# EasyEDA Pro project STM32F412VEx-Core.eprj

# Schematic Schematic1
Create Date: 2022-10-27; Page Name: P1; Project Name: STM32F412VEx-Core; Schematic Name: Schematic1; Update Date: 2022-10-28; Company: 嘉立创EDA; Page Size: A4; Version: V1.0
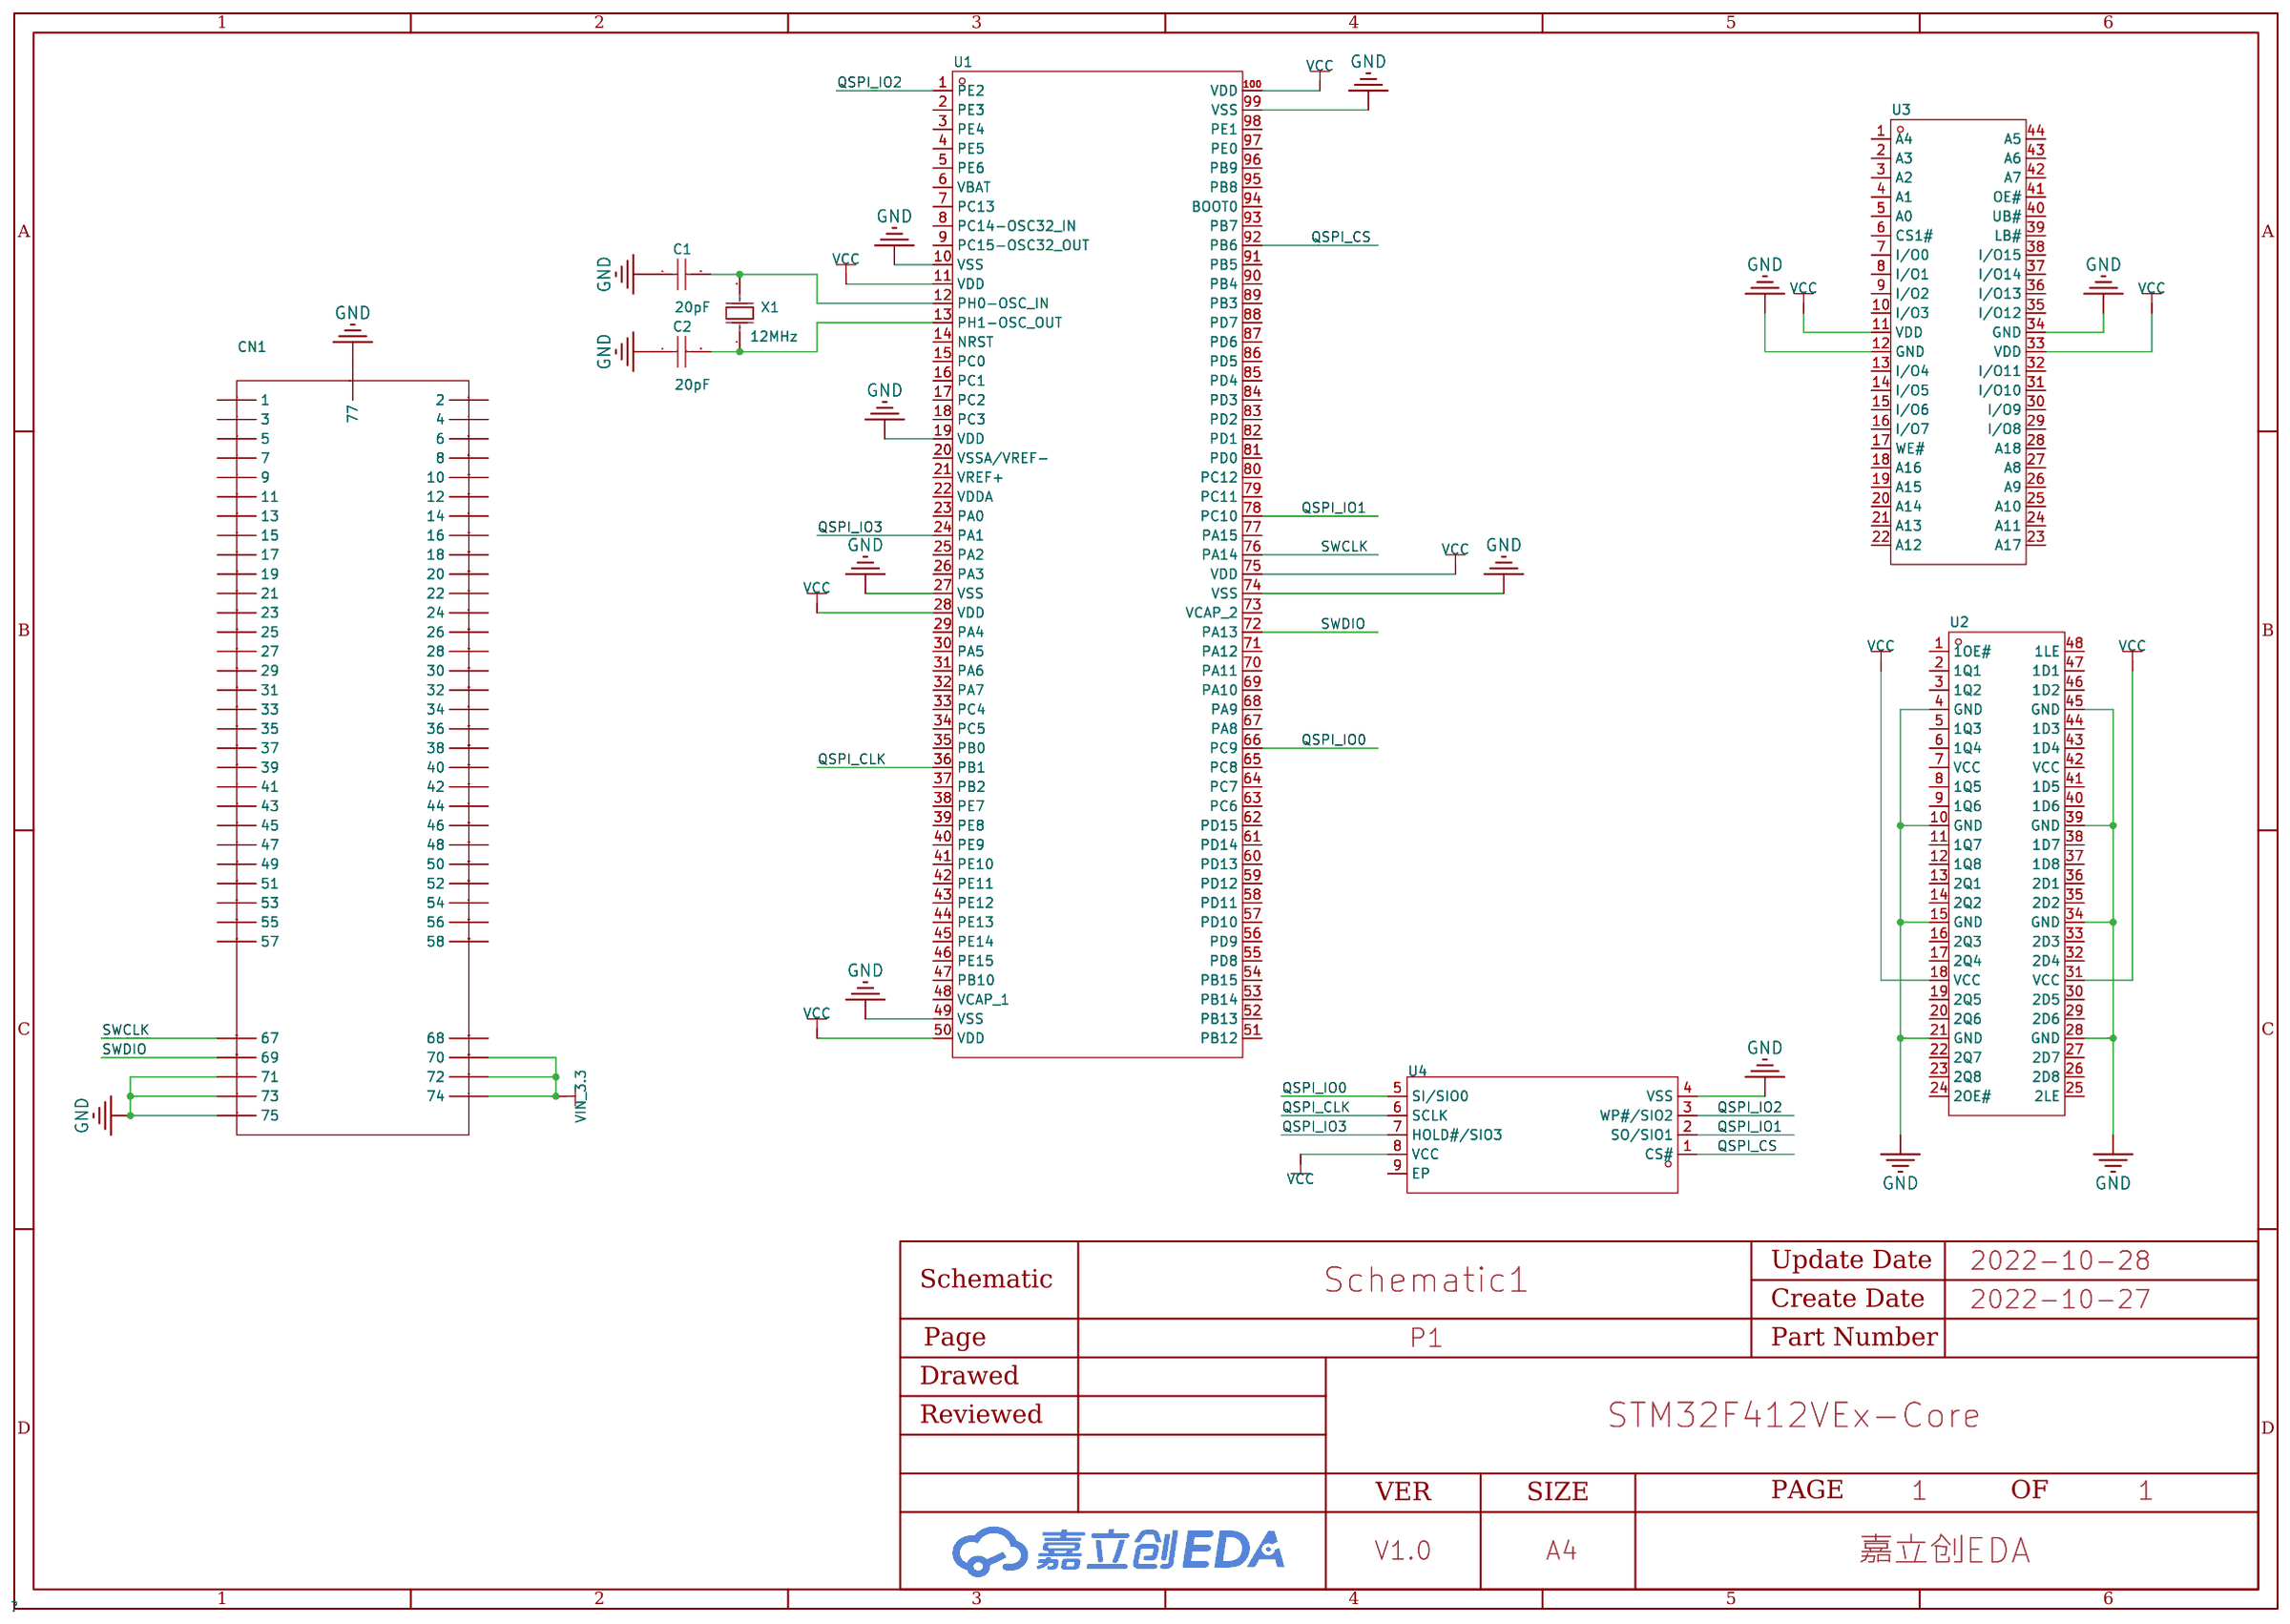
[diagram p0: schematic sheet]

## Parts
C1  20pF  [C0402]
C2  20pF  [C0402]
CN1  -  [M.2_67P_0.5mm_M-key]
U1  STM32F412VET6  [LQFP-100_L14.0-W14.0-P0.50-LS16.0-BL]
U2  SN74ALVCH16373DGGR  [TSSOP-48_L12.6-W6.2-P0.50-LS8.1-BL]
U3  IS62WV51216EBLL-45TLI  [TSOPII-44_L18.4-W10.2-P0.80-LS11.8-BL]
U4  XT26Q01DWSIGA  [WSON-8_L8.0-W6.0-P1.27-TL-EP-1]
X1  12MHz  [OSC-SMD_L5.0-W3.2]

## Library data of the parts
C1 C2 = 0402CG200J500NT: 温度系数:C0G;容值:20pF;精度:±5%;额定电压:50V;; LCSC Part Name: 20pF(200) ±5% 50V; Supplier Part: C1554; Manufacturer: FH(风华); Supplier Footprint: 0402; JLCPCB Part Class: 基础库; Datasheet: https://atta.szlcsc.com/upload/public/pdf/source/20170923/C1554_1506149268708988361.pdf; Supplier: LCSC; Temperature Coefficient: C0G; Tolerance: ±5%; Voltage Rated: 50V
CN1 = M.2_2230_67P_0.5mm_M-key
U1 = STM32F412VET6: Supplier Part: C1337550; Manufacturer: ST(意法半导体); Supplier Footprint: LQFP-100(14x14); JLCPCB Part Class: 扩展库; Datasheet: https://atta.szlcsc.com/upload/public/pdf/source/20200508/C528747_B60DB4B534ED5B42A2F95FC5A7327F53.pdf; Supplier: LCSC
U2 = SN74ALVCH16373DGGR: 系列:74ALVCH;逻辑类型:D 型透明锁存器;输出类型:三态;电压-电源:1.65V ~ 3.6V;; Supplier Part: C139348; Manufacturer: TI(德州仪器); Supplier Footprint: TSSOP-48; JLCPCB Part Class: 扩展库; Datasheet: https://atta.szlcsc.com/upload/public/pdf/source/20171107/C139348_15100518937731097252.pdf; Supplier: LCSC; Series: 74ALVCH; Logic Type: D 型透明锁存器; Output Type: 三态; Voltage - Supply: 1.65V ~ 3.6V
U3 = IS62WV51216EBLL-45TLI: LCSC Part Name: IS62WV51216EBLL 45TLI; Supplier Part: C1348903; Manufacturer: ISSI(美国芯成); Supplier Footprint: TSOP-44; JLCPCB Part Class: 扩展库; Datasheet: https://atta.szlcsc.com/upload/public/pdf/source/20210424/B901F7E8201E5631B8BDF1A41AB0F019.pdf; Supplier: LCSC
U4 = XT26Q01DWSIGA: LCSC Part Name: 1Gbit 1.8V SPI NAND Quad I/O; Supplier Part: C3019013; Manufacturer: XTX(芯天下); Supplier Footprint: 8-WSON(8x6)mm; Datasheet: https://atta.szlcsc.com/upload/public/pdf/source/20220517/C1E7A63E586809554540A7FC37CE75B5.pdf; Supplier: LCSC
X1 = X503212MSB2GI: 晶振类型:贴片无源晶振;频率:12MHz;频率公差:±10ppm;频率稳定度:±50ppm;负载电容:20pF;工作温度:-40~+85;; LCSC Part Name: 12MHz ±10ppm 20pF; Supplier Part: C112573; Manufacturer: YXC(扬兴晶振); Supplier Footprint: SMD5032-2P; JLCPCB Part Class: 扩展库; Datasheet: https://atta.szlcsc.com/upload/public/pdf/source/20210329/C112559_847D3CACBA33ACCEB57DEA3AEBB187A1.pdf; Supplier: LCSC; Crystal Type: 贴片无源晶振; Frequency Tolerance: ±10ppm; Frequency Stability: ±50ppm; Load Capacitance: 20pF; Operating Temperature: -40~+85

## Nets
GND: C1.1 C2.1 CN1.71 CN1.73 CN1.75 CN1.77 U1.10(VSS) U1.19(VDD) U1.27(VSS) U1.49(VSS) U1.74(VSS) U1.99(VSS) U2.4(GND) U2.10(GND) U2.15(GND) U2.21(GND) U2.28(GND) U2.34(GND) U2.39(GND) U2.45(GND) U3.12(GND) U3.34(GND) U4.4(VSS)
VCC: U1.11(VDD) U1.28(VDD) U1.50(VDD) U1.75(VDD) U1.100(VDD) U2.18(VCC) U2.31(VCC) U3.11(VDD) U3.33(VDD) U4.8(VCC)
VIN_3.3: CN1.70 CN1.72 CN1.74
QSPI_CLK: U1.36(PB1) U4.6(SCLK)
QSPI_CS: U1.92(PB6) U4.1(CS#)
QSPI_IO0: U1.66(PC9) U4.5(SI/SIO0)
QSPI_IO1: U1.78(PC10) U4.2(SO/SIO1)
QSPI_IO2: U1.1(PE2) U4.3(WP#/SIO2)
QSPI_IO3: U1.24(PA1) U4.7(HOLD#/SIO3)
SWCLK: CN1.67 U1.76(PA14)
SWDIO: CN1.69 U1.72(PA13)
$1N4704: C2.2 U1.13(PH1-OSC_OUT) X1.1(OSC1)
$1N6546: C1.2 U1.12(PH0-OSC_IN) X1.2(OSC2)

Not connected (* = marked no-connect by the designer): CN1 1 2 3 4 5 6 7 8 9 10 11 12 13 14 15 16 17 18 19 20 21 22 23 24 25 26 27 28 29 30 31 32 33 34 35 36 37 38 39 40 41 42 43 44 45 46 47 48 49 50 51 52 53 54 55 56 57 58 68; U1 2(PE3) 3(PE4) 4(PE5) 5(PE6) 6(VBAT) 7(PC13) 8(PC14-OSC32_IN) 9(PC15-OSC32_OUT) 14(NRST) 15(PC0) 16(PC1) 17(PC2) 18(PC3) 20(VSSA/VREF-) 21(VREF+) 22(VDDA) 23(PA0) 25(PA2) 26(PA3) 29(PA4) 30(PA5) 31(PA6) 32(PA7) 33(PC4) 34(PC5) 35(PB0) 37(PB2) 38(PE7) 39(PE8) 40(PE9) 41(PE10) 42(PE11) 43(PE12) 44(PE13) 45(PE14) 46(PE15) 47(PB10) 48(VCAP_1) 51(PB12) 52(PB13) 53(PB14) 54(PB15) 55(PD8) 56(PD9) 57(PD10) 58(PD11) 59(PD12) 60(PD13) 61(PD14) 62(PD15) 63(PC6) 64(PC7) 65(PC8) 67(PA8) 68(PA9) 69(PA10) 70(PA11) 71(PA12) 73(VCAP_2) 77(PA15) 79(PC11) 80(PC12) 81(PD0) 82(PD1) 83(PD2) 84(PD3) 85(PD4) 86(PD5) 87(PD6) 88(PD7) 89(PB3) 90(PB4) 91(PB5) 93(PB7) 94(BOOT0) 95(PB8) 96(PB9) 97(PE0) 98(PE1); U2 1(1OE#) 2(1Q1) 3(1Q2) 5(1Q3) 6(1Q4) 7(VCC) 8(1Q5) 9(1Q6) 11(1Q7) 12(1Q8) 13(2Q1) 14(2Q2) 16(2Q3) 17(2Q4) 19(2Q5) 20(2Q6) 22(2Q7) 23(2Q8) 24(2OE#) 25(2LE) 26(2D8) 27(2D7) 29(2D6) 30(2D5) 32(2D4) 33(2D3) 35(2D2) 36(2D1) 37(1D8) 38(1D7) 40(1D6) 41(1D5) 42(VCC) 43(1D4) 44(1D3) 46(1D2) 47(1D1) 48(1LE); U3 1(A4) 2(A3) 3(A2) 4(A1) 5(A0) 6(CS1#) 7(I/O0) 8(I/O1) 9(I/O2) 10(I/O3) 13(I/O4) 14(I/O5) 15(I/O6) 16(I/O7) 17(WE#) 18(A16) 19(A15) 20(A14) 21(A13) 22(A12) 23(A17) 24(A11) 25(A10) 26(A9) 27(A8) 28(A18) 29(I/O8) 30(I/O9) 31(I/O10) 32(I/O11) 35(I/O12) 36(I/O13) 37(I/O14) 38(I/O15) 39(LB#) 40(UB#) 41(OE#) 42(A7) 43(A6) 44(A5); U4 9(EP)

# Board PCB2
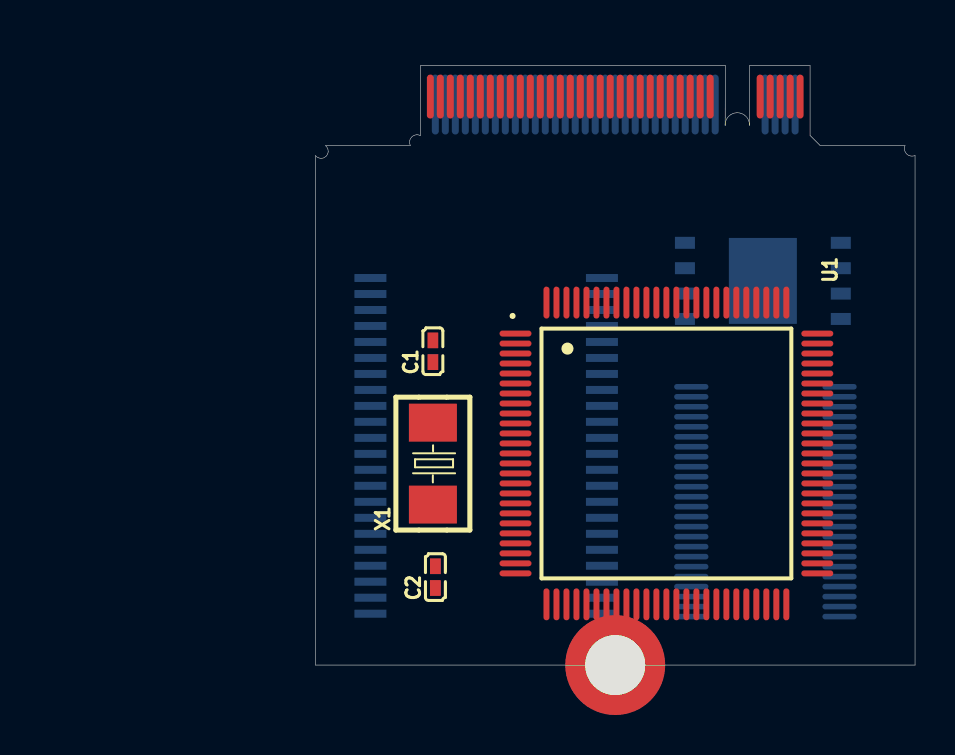
[diagram p1: board, top side]
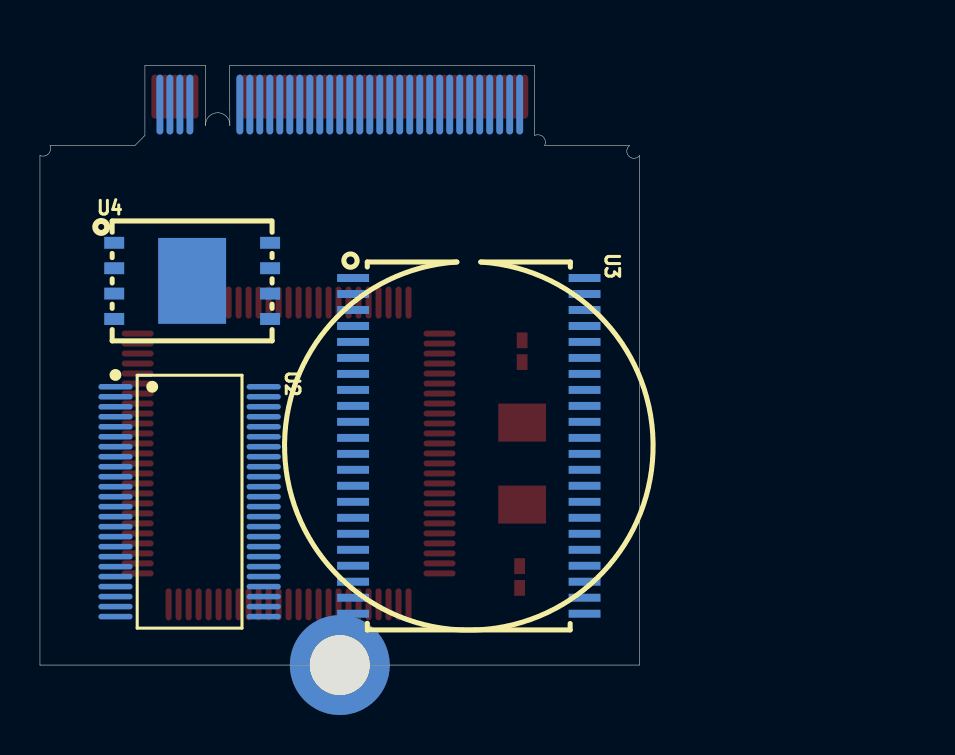
[diagram p2: board, bottom side, seen from below]

Outline 30 x 30 mm; copper layers: Top Layer, Bottom Layer. Coordinates in mm from the lower left corner of the outline.
Stack: Top Layer 0.035mm / Dielectric1 1.51mm FR4 er 4.5 / Bottom Layer 0.035mm

## Design rules (mm)
spacing safeClearance (default): track to track 0.152, other pairs 0.152 to 0.3
track width trackWidth (default): min 0.127, default 0.254, max 2.54
differential pair differentialPair (default): width min 0.127, default 0.254, max 2.54; gap min 0.152, default 0.152
via viaSize (default): diameter min 0.5, default 0.61, max 10; hole min 0.3, default 0.305, max 6

## Placement (name value [footprint] x y rotation side)
C1  20pF  [C0402]  5.88 15.71 90 top
C2  20pF  [C0402]  6 4.4 90 top
CN1  -  [M.2_67P_0.5mm_M-key]  5.75 28.75 0 top
U1  STM32F412VET6  [LQFP-100_L14.0-W14.0-P0.50-LS16.0-BL]  17.56 10.59 270 top
U2  SN74ALVCH16373DGGR  [TSSOP-48_L12.6-W6.2-P0.50-LS8.1-BL]  22.51 8.18 270 bottom
U3  IS62WV51216EBLL-45TLI  [TSOPII-44_L18.4-W10.2-P0.80-LS11.8-BL]  8.54 10.97 270 bottom
U4  XT26Q01DWSIGA  [WSON-8_L8.0-W6.0-P1.27-TL-EP-1]  22.39 19.23 180 bottom
X1  12MHz  [OSC-SMD_L5.0-W3.2]  5.88 10.08 90 top

## Footprints (pads in the part's own frame, mm; a bottom-side part is the same pattern mirrored in y, then rotated)
C0402
  rect 0.79x0.54 smd: 1(-0.545,0) 2(0.545,0)
LQFP-100_L14.0-W14.0-P0.50-LS16.0-BL
  oval 0.3x1.6 smd: 1(-6,-7.55) 2(-5.5,-7.55) 3(-5,-7.55) 4(-4.5,-7.55) 5(-4,-7.55) 6(-3.5,-7.55) 7(-3,-7.55) 8(-2.5,-7.55) 9(-2,-7.55) 10(-1.5,-7.55) 11(-1,-7.55) 12(-0.5,-7.55) 13(0,-7.55) 14(0.5,-7.55) 15(1,-7.55) 16(1.5,-7.55) 17(2,-7.55) 18(2.5,-7.55) 19(3,-7.55) 20(3.5,-7.55) 21(4,-7.55) 22(4.5,-7.55) 23(5,-7.55) 24(5.5,-7.55) 25(6,-7.55) 51(6,7.55) 52(5.5,7.55) 53(5,7.55) 54(4.5,7.55) 55(4,7.55) 56(3.5,7.55) 57(3,7.55) 58(2.5,7.55) 59(2,7.55) 60(1.5,7.55) 61(1,7.55) 62(0.5,7.55) 63(0,7.55) 64(-0.5,7.55) 65(-1,7.55) 66(-1.5,7.55) 67(-2,7.55) 68(-2.5,7.55) 69(-3,7.55) 70(-3.5,7.55) 71(-4,7.55) 72(-4.5,7.55) 73(-5,7.55) 74(-5.5,7.55) 75(-6,7.55)
  oval 1.6x0.3 smd: 26(7.55,-6) 27(7.55,-5.5) 28(7.55,-5) 29(7.55,-4.5) 30(7.55,-4) 31(7.55,-3.5) 32(7.55,-3) 33(7.55,-2.5) 34(7.55,-2) 35(7.55,-1.5) 36(7.55,-1) 37(7.55,-0.5) 38(7.55,0) 39(7.55,0.5) 40(7.55,1) 41(7.55,1.5) 42(7.55,2) 43(7.55,2.5) 44(7.55,3) 45(7.55,3.5) 46(7.55,4) 47(7.55,4.5) 48(7.55,5) 49(7.55,5.5) 50(7.55,6) 76(-7.55,6) 77(-7.55,5.5) 78(-7.55,5) 79(-7.55,4.5) 80(-7.55,4) 81(-7.55,3.5) 82(-7.55,3) 83(-7.55,2.5) 84(-7.55,2) 85(-7.55,1.5) 86(-7.55,1) 87(-7.55,0.5) 88(-7.55,0) 89(-7.55,-0.5) 90(-7.55,-1) 91(-7.55,-1.5) 92(-7.55,-2) 93(-7.55,-2.5) 94(-7.55,-3) 95(-7.55,-3.5) 96(-7.55,-4) 97(-7.55,-4.5) 98(-7.55,-5) 99(-7.55,-5.5) 100(-7.55,-6)
M.2_67P_0.5mm_M-key
  oval 0.35x2.2 smd: 1(0,-0.3) 3(0.5,-0.3) 5(1,-0.3) 7(1.5,-0.3) 9(2,-0.3) 11(2.5,-0.3) 13(3,-0.3) 15(3.5,-0.3) 17(4,-0.3) 19(4.5,-0.3) 21(5,-0.3) 23(5.5,-0.3) 25(6,-0.3) 27(6.5,-0.3) 29(7,-0.3) 31(7.5,-0.3) 33(8,-0.3) 35(8.5,-0.3) 37(9,-0.3) 39(9.5,-0.3) 41(10,-0.3) 43(10.5,-0.3) 45(11,-0.3) 47(11.5,-0.3) 49(12,-0.3) 51(12.5,-0.3) 53(13,-0.3) 55(13.5,-0.3) 57(14,-0.3) 67(16.5,-0.3) 69(17,-0.3) 71(17.5,-0.3) 73(18,-0.3) 75(18.5,-0.3)
  oval 0.35x3 smd far side: 2(0.25,-0.7) 4(0.75,-0.7) 6(1.25,-0.7) 8(1.75,-0.7) 10(2.25,-0.7) 12(2.75,-0.7) 14(3.25,-0.7) 16(3.75,-0.7) 18(4.25,-0.7) 20(4.75,-0.7) 22(5.25,-0.7) 24(5.75,-0.7) 26(6.25,-0.7) 28(6.75,-0.7) 30(7.25,-0.7) 32(7.75,-0.7) 34(8.25,-0.7) 36(8.75,-0.7) 38(9.25,-0.7) 40(9.75,-0.7) 42(10.25,-0.7) 44(10.75,-0.7) 46(11.25,-0.7) 48(11.75,-0.7) 50(12.25,-0.7) 52(12.75,-0.7) 54(13.25,-0.7) 56(13.75,-0.7) 58(14.25,-0.7) 68(16.75,-0.7) 70(17.25,-0.7) 72(17.75,-0.7) 74(18.25,-0.7)
  round 5 hole 3: 77(9.25,-28.75)
OSC-SMD_L5.0-W3.2
  rect 1.9x2.4 smd: 1(-2.05,0) 2(2.05,0)
TSOPII-44_L18.4-W10.2-P0.80-LS11.8-BL
  rect 0.399x1.6 smd: 1(-8.4,-5.791) 2(-7.599,-5.791) 3(-6.8,-5.791) 4(-6,-5.791) 5(-5.199,-5.791) 6(-4.399,-5.791) 7(-3.599,-5.791) 8(-2.799,-5.791) 9(-1.999,-5.791) 10(-1.202,-5.791) 11(-0.399,-5.791) 12(0.402,-5.791) 13(1.199,-5.791) 14(1.999,-5.791) 15(2.801,-5.791) 16(3.602,-5.791) 17(4.402,-5.791) 18(5.202,-5.791) 19(6,-5.791) 20(6.8,-5.791) 21(7.599,-5.791) 22(8.4,-5.791) 23(8.4,5.791) 24(7.599,5.791) 25(6.8,5.791) 26(6,5.791) 27(5.202,5.791) 28(4.402,5.791) 29(3.602,5.791) 30(2.801,5.791) 31(1.999,5.791) 32(1.199,5.791) 33(0.402,5.791) 34(-0.399,5.791) 35(-1.202,5.791) 36(-1.999,5.791) 37(-2.799,5.791) 38(-3.599,5.791) 39(-4.399,5.791) 40(-5.199,5.791) 41(-6,5.791) 42(-6.8,5.791) 43(-7.599,5.791) 44(-8.4,5.791)
TSSOP-48_L12.6-W6.2-P0.50-LS8.1-BL
  oval 0.28x1.714 smd: 1(-5.75,-3.708) 2(-5.25,-3.708) 3(-4.75,-3.708) 4(-4.25,-3.708) 5(-3.749,-3.708) 6(-3.248,-3.708) 7(-2.751,-3.708) 8(-2.251,-3.708) 9(-1.75,-3.708) 10(-1.25,-3.708) 11(-0.75,-3.708) 12(-0.249,-3.708) 13(0.249,-3.708) 14(0.75,-3.708) 15(1.25,-3.708) 16(1.75,-3.708) 17(2.251,-3.708) 18(2.751,-3.708) 19(3.251,-3.708) 20(3.749,-3.708) 21(4.25,-3.708) 22(4.75,-3.708) 23(5.25,-3.708) 24(5.75,-3.708) 25(5.75,3.708) 26(5.25,3.708) 27(4.75,3.708) 28(4.25,3.708) 29(3.749,3.708) 30(3.251,3.708) 31(2.751,3.708) 32(2.251,3.708) 33(1.75,3.708) 34(1.25,3.708) 35(0.75,3.708) 36(0.249,3.708) 37(-0.249,3.708) 38(-0.75,3.708) 39(-1.25,3.708) 40(-1.75,3.708) 41(-2.251,3.708) 42(-2.751,3.708) 43(-3.248,3.708) 44(-3.749,3.708) 45(-4.25,3.708) 46(-4.75,3.708) 47(-5.25,3.708) 48(-5.75,3.708)
WSON-8_L8.0-W6.0-P1.27-TL-EP-1
  rect 1.001x0.6 smd: 1(-3.899,1.905) 2(-3.899,0.635) 3(-3.899,-0.635) 4(-3.899,-1.905) 5(3.899,-1.905) 6(3.899,-0.635) 7(3.899,0.635) 8(3.899,1.905)
  rect 3.401x4.3 smd: 9(0,0)

## Nets
As in the schematic.

Pads without a net: CN1 1 2 3 4 5 6 7 8 9 10 11 12 13 14 15 16 17 18 19 20 21 22 23 24 25 26 27 28 29 30 31 32 33 34 35 36 37 38 39 40 41 42 43 44 45 46 47 48 49 50 51 52 53 54 55 56 57 58 68; U1 2 3 4 5 6 7 8 9 14 15 16 17 18 20 21 22 23 25 26 29 30 31 32 33 34 35 37 38 39 40 41 42 43 44 45 46 47 48 51 52 53 54 55 56 57 58 59 60 61 62 63 64 65 67 68 69 70 71 73 77 79 80 81 82 83 84 85 86 87 88 89 90 91 93 94 95 96 97 98; U2 1 2 3 5 6 7 8 9 11 12 13 14 16 17 19 20 22 23 24 25 26 27 29 30 32 33 35 36 37 38 40 41 42 43 44 46 47 48; U3 1 2 3 4 5 6 7 8 9 10 13 14 15 16 17 18 19 20 21 22 23 24 25 26 27 28 29 30 31 32 35 36 37 38 39 40 41 42 43 44; U4 9
